# Altium schematic sheet fpga-bank0.SchDoc: FPGA - Bank 0
size Letter; CheckedBy: E. Chiu; CompanyName: Brinton Engineering, LLC; DrawnBy: J. Brinton; Engineer: J. Brinton; Address1: 3479 Edison Way; Address2: Menlo Park CA 94025; Address3: +1 (877) 778-8435; Address4: brintonengineering.com; Revision: 1; SheetNumber: 8; SheetTotal: 48
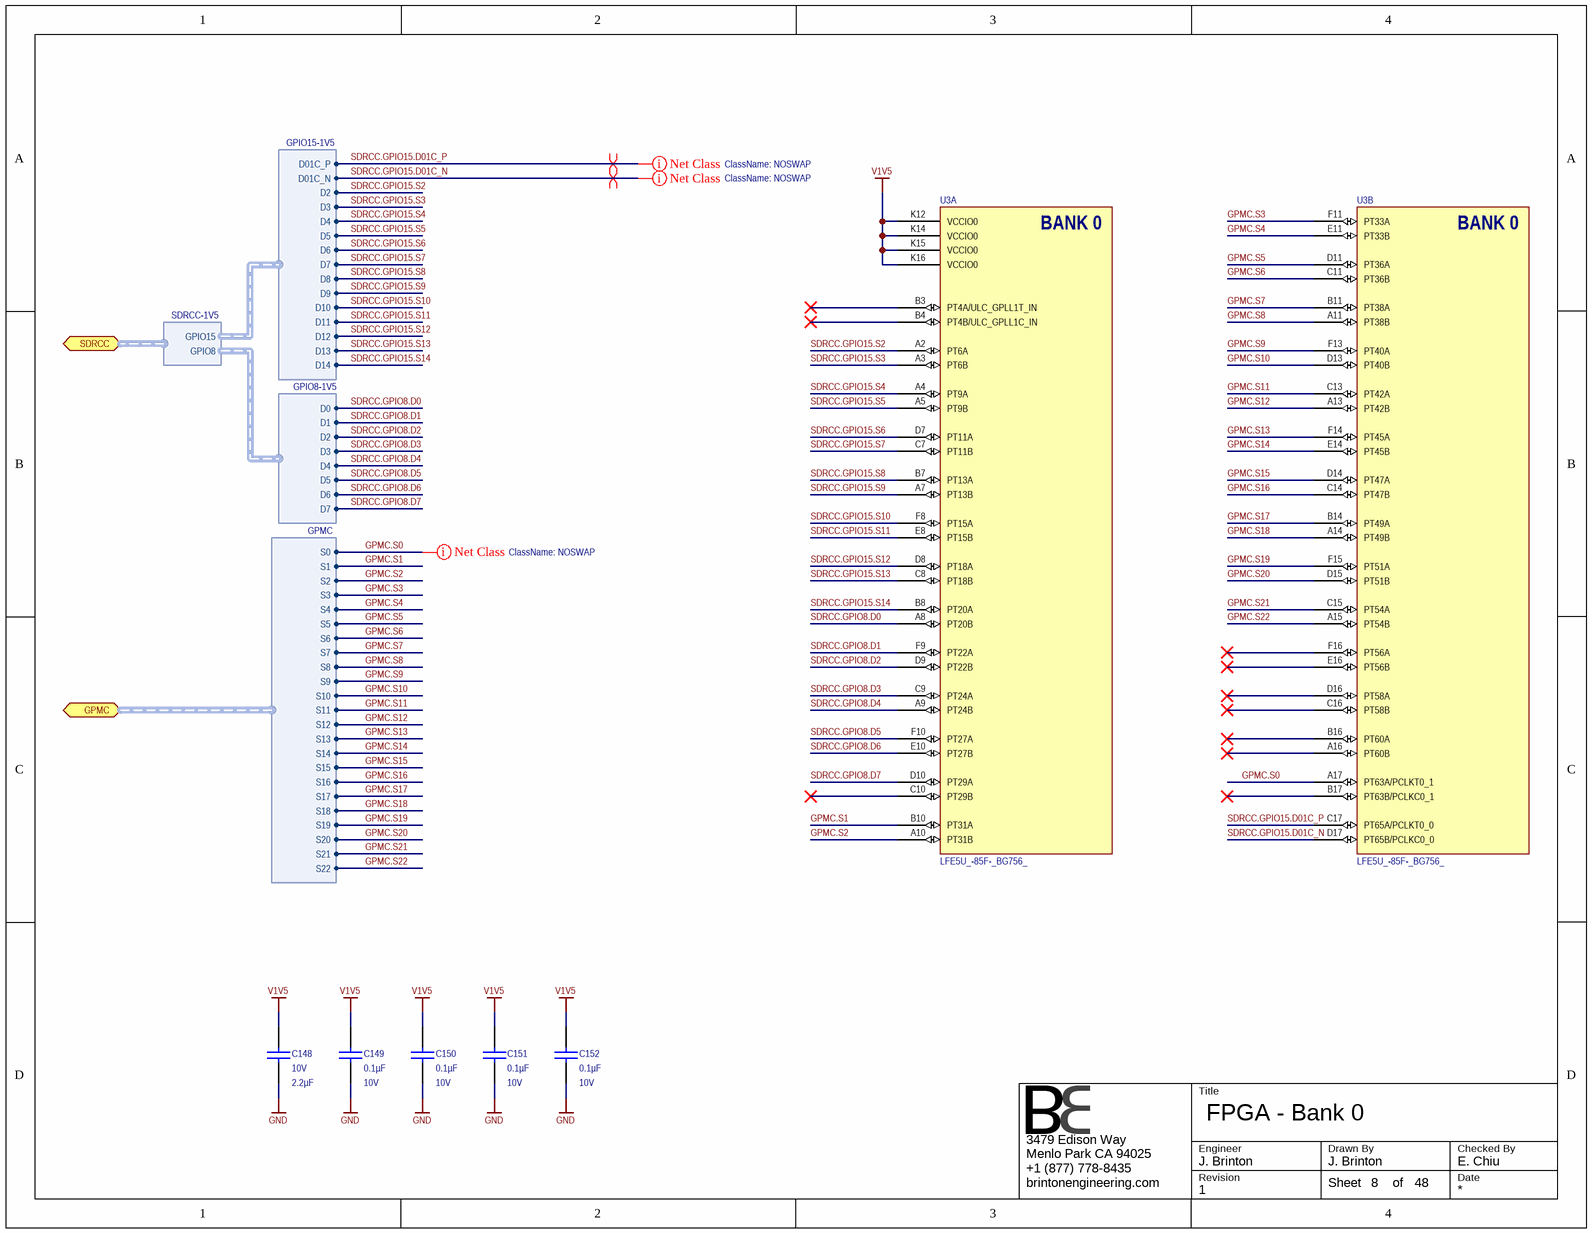
[diagram p0: fpga-bank0.SchDoc]

## Parts
C148  Voltage - Rated: 10V  Capacitance: 2.2µF  [CAPC1608X90N]  (hidden comment: GRM188R71A225KE15D)
C149  Capacitance: 0.1µF  Voltage - Rated: 10V  [CAPC1005X56N]  (hidden comment: GRM155R71A104KA01J)
C150  Capacitance: 0.1µF  Voltage - Rated: 10V  [CAPC1005X56N]  (hidden comment: GRM155R71A104KA01J)
C151  Capacitance: 0.1µF  Voltage - Rated: 10V  [CAPC1005X56N]  (hidden comment: GRM155R71A104KA01J)
C152  Capacitance: 0.1µF  Voltage - Rated: 10V  [CAPC1005X56N]  (hidden comment: GRM155R71A104KA01J)
U3  LFE5U_-85F-_BG756_  [caBGA756]  (parts A,B of 19)

## Ports
GPMC (harness GPMC), SDRCC (harness SDRCC-1V5)

## Harnesses
GPMC: S0, S1, S2, S3, S4, S5, S6, S7, S8, S9, S10, S11, S12, S13, S14, S15, S16, S17, S18, S19, S20, S21, S22
GPIO8-1V5: D0, D1, D2, D3, D4, D5, D6, D7
GPIO15-1V5: D01C_P, D01C_N, D2, D3, D4, D5, D6, D7, D8, D9, D10, D11, D12, D13, D14
SDRCC-1V5: GPIO15, GPIO8

## Nets
GND: C148.1 C149.1 C150.1 C151.1 C152.1
V1V5: C148.2 C149.2 C150.2 C151.2 C152.2 U3.K12(VCCIO0) U3.K14(VCCIO0) U3.K15(VCCIO0) U3.K16(VCCIO0)
GPMC.S0: U3.A17(PT63A/PCLKT0_1) ; port GPMC.S0
GPMC.S1: U3.B10(PT31A) ; port GPMC.S1
GPMC.S2: U3.A10(PT31B) ; port GPMC.S2
GPMC.S3: U3.F11(PT33A) ; port GPMC.S3
GPMC.S4: U3.E11(PT33B) ; port GPMC.S4
GPMC.S5: U3.D11(PT36A) ; port GPMC.S5
GPMC.S6: U3.C11(PT36B) ; port GPMC.S6
GPMC.S7: U3.B11(PT38A) ; port GPMC.S7
GPMC.S8: U3.A11(PT38B) ; port GPMC.S8
GPMC.S9: U3.F13(PT40A) ; port GPMC.S9
GPMC.S10: U3.D13(PT40B) ; port GPMC.S10
GPMC.S11: U3.C13(PT42A) ; port GPMC.S11
GPMC.S12: U3.A13(PT42B) ; port GPMC.S12
GPMC.S13: U3.F14(PT45A) ; port GPMC.S13
GPMC.S14: U3.E14(PT45B) ; port GPMC.S14
GPMC.S15: U3.D14(PT47A) ; port GPMC.S15
GPMC.S16: U3.C14(PT47B) ; port GPMC.S16
GPMC.S17: U3.B14(PT49A) ; port GPMC.S17
GPMC.S18: U3.A14(PT49B) ; port GPMC.S18
GPMC.S19: U3.F15(PT51A) ; port GPMC.S19
GPMC.S20: U3.D15(PT51B) ; port GPMC.S20
GPMC.S21: U3.C15(PT54A) ; port GPMC.S21
GPMC.S22: U3.A15(PT54B) ; port GPMC.S22
SDRCC.GPIO8.D0: U3.A8(PT20B) ; harness GPIO8-1V5.D0
SDRCC.GPIO8.D1: U3.F9(PT22A) ; harness GPIO8-1V5.D1
SDRCC.GPIO8.D2: U3.D9(PT22B) ; harness GPIO8-1V5.D2
SDRCC.GPIO8.D3: U3.C9(PT24A) ; harness GPIO8-1V5.D3
SDRCC.GPIO8.D4: U3.A9(PT24B) ; harness GPIO8-1V5.D4
SDRCC.GPIO8.D5: U3.F10(PT27A) ; harness GPIO8-1V5.D5
SDRCC.GPIO8.D6: U3.E10(PT27B) ; harness GPIO8-1V5.D6
SDRCC.GPIO8.D7: U3.D10(PT29A) ; harness GPIO8-1V5.D7
SDRCC.GPIO15.D01C_N: U3.D17(PT65B/PCLKC0_0) ; harness GPIO15-1V5.D01C_N
SDRCC.GPIO15.D01C_P: U3.C17(PT65A/PCLKT0_0) ; harness GPIO15-1V5.D01C_P
SDRCC.GPIO15.S2: U3.A2(PT6A) ; harness GPIO15-1V5.D2
SDRCC.GPIO15.S3: U3.A3(PT6B) ; harness GPIO15-1V5.D3
SDRCC.GPIO15.S4: U3.A4(PT9A) ; harness GPIO15-1V5.D4
SDRCC.GPIO15.S5: U3.A5(PT9B) ; harness GPIO15-1V5.D5
SDRCC.GPIO15.S6: U3.D7(PT11A) ; harness GPIO15-1V5.D6
SDRCC.GPIO15.S7: U3.C7(PT11B) ; harness GPIO15-1V5.D7
SDRCC.GPIO15.S8: U3.B7(PT13A) ; harness GPIO15-1V5.D8
SDRCC.GPIO15.S9: U3.A7(PT13B) ; harness GPIO15-1V5.D9
SDRCC.GPIO15.S10: U3.F8(PT15A) ; harness GPIO15-1V5.D10
SDRCC.GPIO15.S11: U3.E8(PT15B) ; harness GPIO15-1V5.D11
SDRCC.GPIO15.S12: U3.D8(PT18A) ; harness GPIO15-1V5.D12
SDRCC.GPIO15.S13: U3.C8(PT18B) ; harness GPIO15-1V5.D13
SDRCC.GPIO15.S14: U3.B8(PT20A) ; harness GPIO15-1V5.D14

Not connected (* = marked no-connect by the designer): U3 A16(PT60B)* B3(PT4A/ULC_GPLL1T_IN)* B4(PT4B/ULC_GPLL1C_IN)* B16(PT60A)* B17(PT63B/PCLKC0_1)* C10(PT29B)* C16(PT58B)* D16(PT58A)* E16(PT56B)* F16(PT56A)*

## Layout directives
net class NOSWAP: GPMC.S0, SDRCC.GPIO15.D01C_N, SDRCC.GPIO15.D01C_P
differential pair: SDRCC.GPIO15.D01C_N, SDRCC.GPIO15.D01C_P

## Notes on the sheet
- Title
- Engineer
- Revision
- Drawn By
- Checked By
- Date
- Sheet
- of
- (in symbol LFE5U_-85F-_BG756_, part A) BANK 0
- (in symbol LFE5U_-85F-_BG756_, part B) BANK 0

## Library data of the parts
C148 = GRM188R71A225KE15D: CAP CER 2.2UF 10V 10% X7R 0603; Manufacturer: Murata Electronics North America; Manufacturer P/N: GRM188R71A225KE15D; Operating Temperature: -55°C ~ 125°C; Thickness (Max): 0.035" (0.90mm); Tolerance: ±10%; Package / Case: 0603 (1608 Metric); Temperature Coefficient: X7R; Supplier 1: Newark; Supplier 2: Digi-Key; RoHS: RoHS Compliant; Size / Dimension: 0.063" L x 0.031" W (1.60mm x 0.80mm); Mounting Type: Surface Mount, MLCC; ComponentLink1URL: http://www.murata.com/~/media/webrenewal/support/library/catalog/products/capacitor/mlcc/c02e.ashx; ComponentLink1Description: http://www.murata.com/~/media/webrenewal/support/library/catalog/products/capacitor/mlcc/c02e.ashx; Supplier Part Number 1: 72R4209; Supplier Part Number 2: 490-4520-1-ND
C149-C152 = GRM155R71A104KA01J: CAP CER 0.1UF 10V 10% X7R 0402; Manufacturer: Murata Electronics North America; Manufacturer P/N: GRM155R71A104KA01J; Operating Temperature: -55°C ~ 125°C; Thickness (Max): 0.022" (0.55mm); Size / Dimension: 0.039" L x 0.020" W (1.00mm x 0.50mm); RoHS: RoHS Compliant; Mounting Type: Surface Mount, MLCC; Supplier 1: Digi-Key; ComponentLink1URL: http://www.murata.com/~/media/webrenewal/support/library/catalog/products/capacitor/mlcc/c02e.ashx; ComponentLink1Description: http://www.murata.com/~/media/webrenewal/support/library/catalog/products/capacitor/mlcc/c02e.ashx; Supplier Part Number 1: 490-6322-1-ND; Temperature Coefficient: X7R; Package / Case: 0402 (1005 Metric); Tolerance: ±10%
U3 = LFE5U_-85F-_BG756_: ECP5 FPGA, 85k LUT, 756-caBGA; Manufacturer: Lattice Semiconductor; Manufacturer P/N: LFE5U_-85F-_BG756_